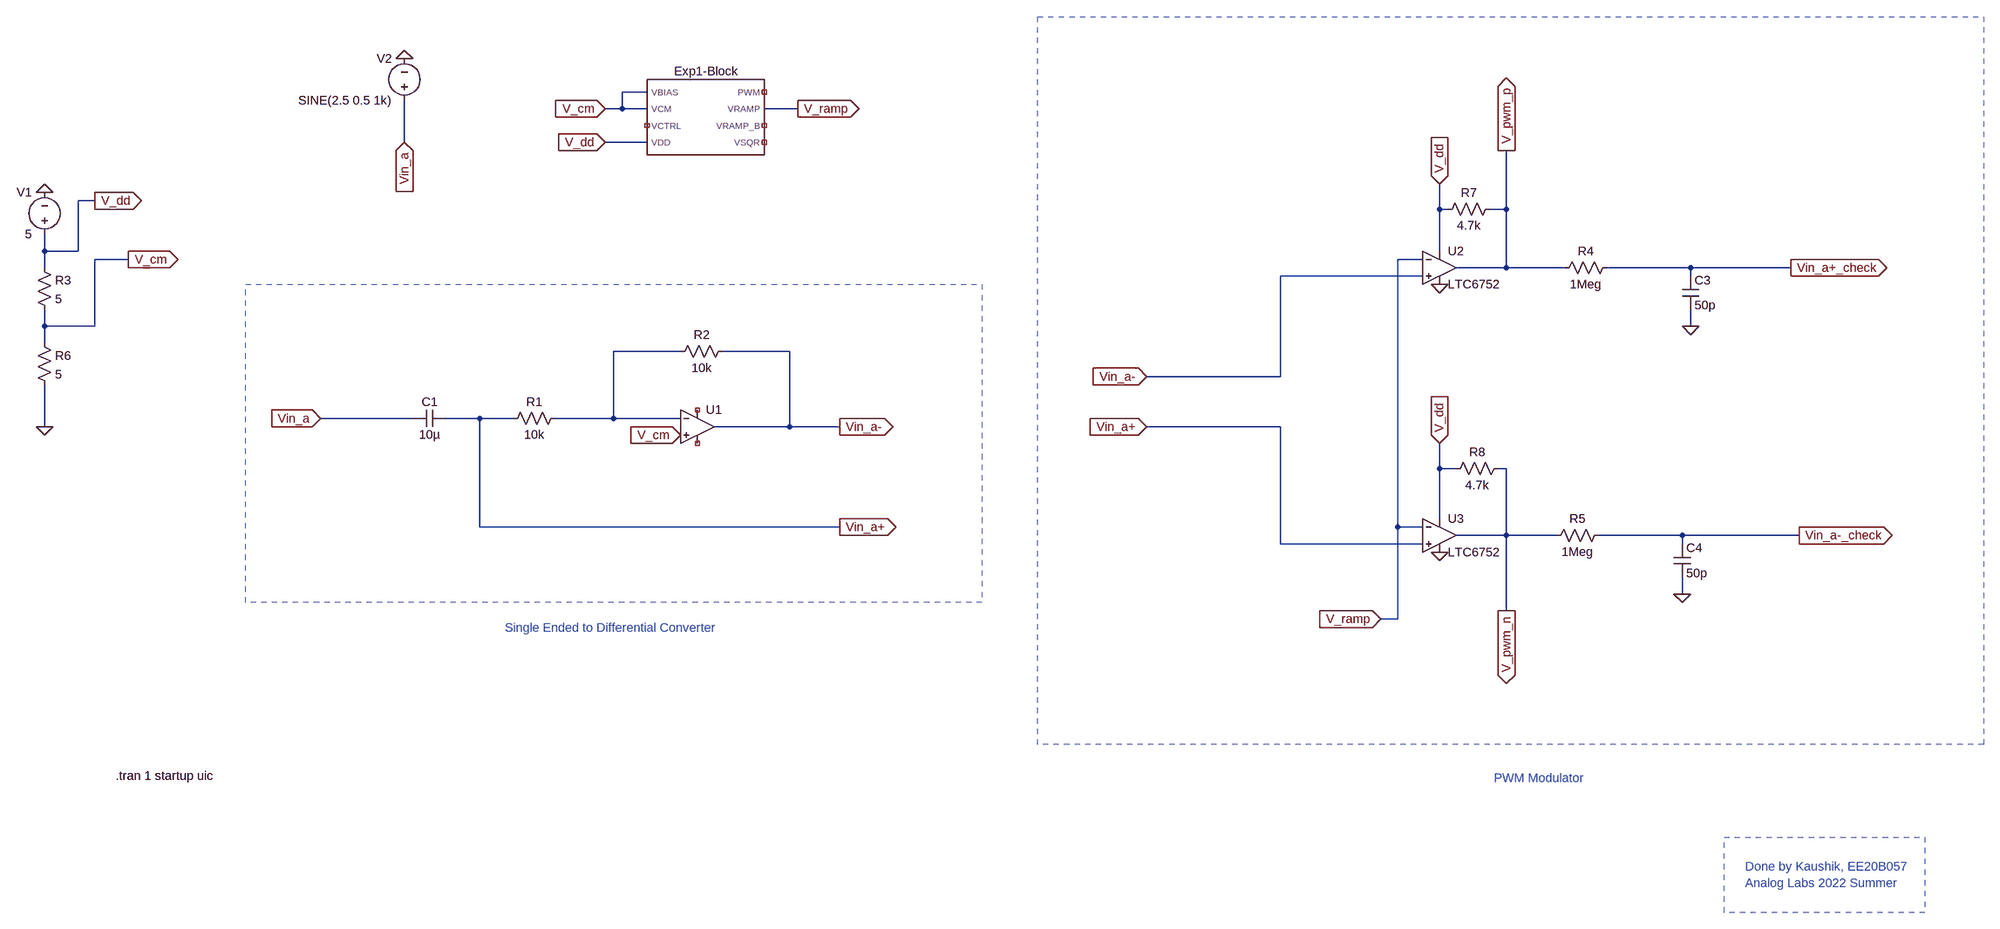
[diagram p0: schematic Exp_4_Simulation.asc]
Exp_4_Simulation.asc, the LTspice schematic file:
Version 4
SHEET 1 3316 1092
WIRE 704 -496 656 -496
WIRE 656 -464 656 -496
WIRE 656 -464 624 -464
WIRE 704 -464 656 -464
WIRE 992 -464 928 -464
WIRE 240 -400 240 -480
WIRE 704 -400 624 -400
WIRE -352 -288 -384 -288
WIRE 2272 -272 2272 -320
WIRE 2288 -272 2272 -272
WIRE 2400 -272 2400 -384
WIRE 2400 -272 2368 -272
WIRE -448 -192 -448 -224
WIRE -384 -192 -384 -288
WIRE -384 -192 -448 -192
WIRE 2272 -192 2272 -272
WIRE -288 -176 -352 -176
WIRE 2240 -176 2192 -176
WIRE -448 -160 -448 -192
WIRE 2400 -160 2400 -272
WIRE 2400 -160 2304 -160
WIRE 2512 -160 2400 -160
WIRE 2752 -160 2592 -160
WIRE 2944 -160 2752 -160
WIRE 2240 -144 1968 -144
WIRE 2752 -144 2752 -160
WIRE -448 -48 -448 -80
WIRE -352 -48 -352 -176
WIRE -352 -48 -448 -48
WIRE 2752 -48 2752 -80
WIRE -448 -16 -448 -48
WIRE 768 0 640 0
WIRE 976 0 848 0
WIRE 1968 48 1968 -144
WIRE 1968 48 1712 48
WIRE 256 128 80 128
WIRE 384 128 320 128
WIRE 448 128 384 128
WIRE 640 128 640 0
WIRE 640 128 528 128
WIRE 768 128 640 128
WIRE -448 144 -448 64
WIRE 976 144 976 0
WIRE 976 144 832 144
WIRE 1072 144 976 144
WIRE 1968 144 1712 144
WIRE 2272 224 2272 176
WIRE 2304 224 2272 224
WIRE 2400 224 2384 224
WIRE 2272 320 2272 224
WIRE 384 336 384 128
WIRE 1072 336 384 336
WIRE 2192 336 2192 -176
WIRE 2240 336 2192 336
WIRE 2400 352 2400 224
WIRE 2400 352 2304 352
WIRE 2496 352 2400 352
WIRE 2736 352 2576 352
WIRE 2960 352 2736 352
WIRE 1968 368 1968 144
WIRE 2240 368 1968 368
WIRE 2736 368 2736 352
WIRE 2736 464 2736 432
WIRE 2400 496 2400 352
WIRE 2192 512 2192 336
WIRE 2192 512 2160 512
FLAG 80 128 Vin_a
IOPIN 80 128 In
FLAG 1072 144 Vin_a-
IOPIN 1072 144 Out
FLAG 1072 336 Vin_a+
IOPIN 1072 336 Out
FLAG 2160 512 V_ramp
IOPIN 2160 512 In
FLAG 1712 48 Vin_a-
IOPIN 1712 48 In
FLAG 1712 144 Vin_a+
IOPIN 1712 144 In
FLAG 2400 -384 V_pwm_p
IOPIN 2400 -384 Out
FLAG 2400 496 V_pwm_n
IOPIN 2400 496 Out
FLAG 2752 -48 0
FLAG 2736 464 0
FLAG 2944 -160 Vin_a+_check
IOPIN 2944 -160 Out
FLAG 2960 352 Vin_a-_check
IOPIN 2960 352 Out
FLAG -448 -304 0
FLAG -448 144 0
FLAG -288 -176 V_cm
IOPIN -288 -176 Out
FLAG 624 -464 V_cm
IOPIN 624 -464 In
FLAG -352 -288 V_dd
IOPIN -352 -288 Out
FLAG 624 -400 V_dd
IOPIN 624 -400 In
FLAG 2272 -320 V_dd
IOPIN 2272 -320 In
FLAG 2272 176 V_dd
IOPIN 2272 176 In
FLAG 2272 -128 0
FLAG 2272 384 0
FLAG 992 -464 V_ramp
IOPIN 992 -464 Out
FLAG 240 -560 0
FLAG 240 -400 Vin_a
IOPIN 240 -400 In
FLAG 768 160 V_cm
IOPIN 768 160 In
SYMBOL cap 320 112 R90
WINDOW 0 0 32 VBottom 2
WINDOW 3 32 32 VTop 2
SYMATTR InstName C1
SYMATTR Value 10µ
SYMBOL res 544 112 R90
WINDOW 0 0 56 VBottom 2
WINDOW 3 32 56 VTop 2
SYMATTR InstName R1
SYMATTR Value 10k
SYMBOL res 864 -16 R90
WINDOW 0 0 56 VBottom 2
WINDOW 3 32 56 VTop 2
SYMATTR InstName R2
SYMATTR Value 10k
SYMBOL OpAmps\\UniversalOpAmp 800 144 R0
SYMATTR InstName U1
SYMBOL Comparators\\LTC6752 2272 -224 R0
SYMATTR InstName U2
SYMBOL Comparators\\LTC6752 2272 288 R0
SYMATTR InstName U3
SYMBOL res 2608 -176 R90
WINDOW 0 0 56 VBottom 2
WINDOW 3 32 56 VTop 2
SYMATTR InstName R4
SYMATTR Value 1Meg
SYMBOL cap 2736 -144 R0
SYMATTR InstName C3
SYMATTR Value 50p
SYMBOL res 2592 336 R90
WINDOW 0 0 56 VBottom 2
WINDOW 3 32 56 VTop 2
SYMATTR InstName R5
SYMATTR Value 1Meg
SYMBOL cap 2720 368 R0
SYMATTR InstName C4
SYMATTR Value 50p
SYMBOL Exp_1_block 816 -448 R0
SYMATTR InstName Exp1-Block
SYMBOL voltage -448 -208 R180
WINDOW 0 24 96 Left 2
WINDOW 3 24 16 Left 2
WINDOW 123 0 0 Left 0
WINDOW 39 0 0 Left 0
SYMATTR InstName V1
SYMATTR Value 5
SYMBOL res -464 -176 R0
SYMATTR InstName R3
SYMATTR Value 5
SYMBOL res -464 -32 R0
SYMATTR InstName R6
SYMATTR Value 5
SYMBOL res 2384 -288 R90
WINDOW 0 0 56 VBottom 2
WINDOW 3 32 56 VTop 2
SYMATTR InstName R7
SYMATTR Value 4.7k
SYMBOL res 2400 208 R90
WINDOW 0 0 56 VBottom 2
WINDOW 3 32 56 VTop 2
SYMATTR InstName R8
SYMATTR Value 4.7k
SYMBOL voltage 240 -464 R180
WINDOW 0 24 96 Left 2
WINDOW 3 24 16 Left 2
WINDOW 123 0 0 Left 0
WINDOW 39 0 0 Left 0
SYMATTR InstName V2
SYMATTR Value SINE(2.5 0.5 1k)
TEXT -312 812 Left 2 !.tran 1 startup uic
TEXT 432 528 Left 2 ;Single Ended to Differential Converter
TEXT 2376 816 Left 2 ;PWM Modulator
TEXT 2856 1000 Left 2 ;Done by Kaushik, EE20B057
TEXT 2856 1032 Left 2 ;Analog Labs 2022 Summer
RECTANGLE Normal 1344 480 -64 -128 2
RECTANGLE Normal 3312 752 1504 -640 2
RECTANGLE Normal 3200 1088 2816 944 2

The netlist it stands for:
* Exp_4_Simulation.asc
C1 Vin_a+ Vin_a 10µ
R1 N001 Vin_a+ 10k
R2 Vin_a- N001 10k
XU1 V_cm N001 NC_01 NC_02 Vin_a- level1 Avol=1Meg GBW=10Meg Vos=0 En=0 Enk=0 In=0 Ink=0 Rin=500Meg  ; pins In+ In- V+ V- OUT
XU2 Vin_a- V_ramp V_dd 0 V_pwm_p LTC6752  ; pins In+ In- V+ V- OUT
XU3 Vin_a+ V_ramp V_dd 0 V_pwm_n LTC6752  ; pins In+ In- V+ V- OUT
R4 Vin_a+_check V_pwm_p 1Meg
C3 Vin_a+_check 0 50p
R5 Vin_a-_check V_pwm_n 1Meg
C4 Vin_a-_check 0 50p
XExp1-Block V_cm V_cm NC_03 V_dd NC_04 V_ramp NC_05 NC_06 Exp_1_block  ; pins VBIAS VCM VCTRL VDD PWM VRAMP VRAMP_B VSQR
V1 V_dd 0 5
R3 V_dd V_cm 5
R6 V_cm 0 5
R7 V_pwm_p V_dd 4.7k
R8 V_pwm_n V_dd 4.7k
V2 Vin_a 0 SINE(2.5 0.5 1k)
.tran 1 startup uic
* Single Ended to Differential Converter
* PWM Modulator
* Done by Kaushik, EE20B057
* Analog Labs 2022 Summer
.lib UniversalOpAmp1.lib
.lib LTC7.lib
.backanno
.end